# Altium project Luna v2.PrjPcb (part 4 of 7)

## Sheet 10 FLASH_BOOT.SchDoc: Luna v2
size A2; VersionControl_RevNumber: DNP; IsUserConfigurable: DNP; OrgAddr3: Sunrise FL 33323; OrgName: Pixels on Target; Page Create Date: March  8, 1995; Page Number: 5; Page Size: A2; Page Count: 14; OrgAddr2: Suite #104; RevCode: A; Doc: SCH30-00070-00; DsnPath: C:\Users\Carter Nichols\Documents\BitBucket boards (Cadence)\30-00070-00_Original\SCH30-00070-00.DSN; SchematicName: SC30-00070-00; PageName: 05-POWER IN; PageSize: A2; TopSchematic: True; Address4: United States
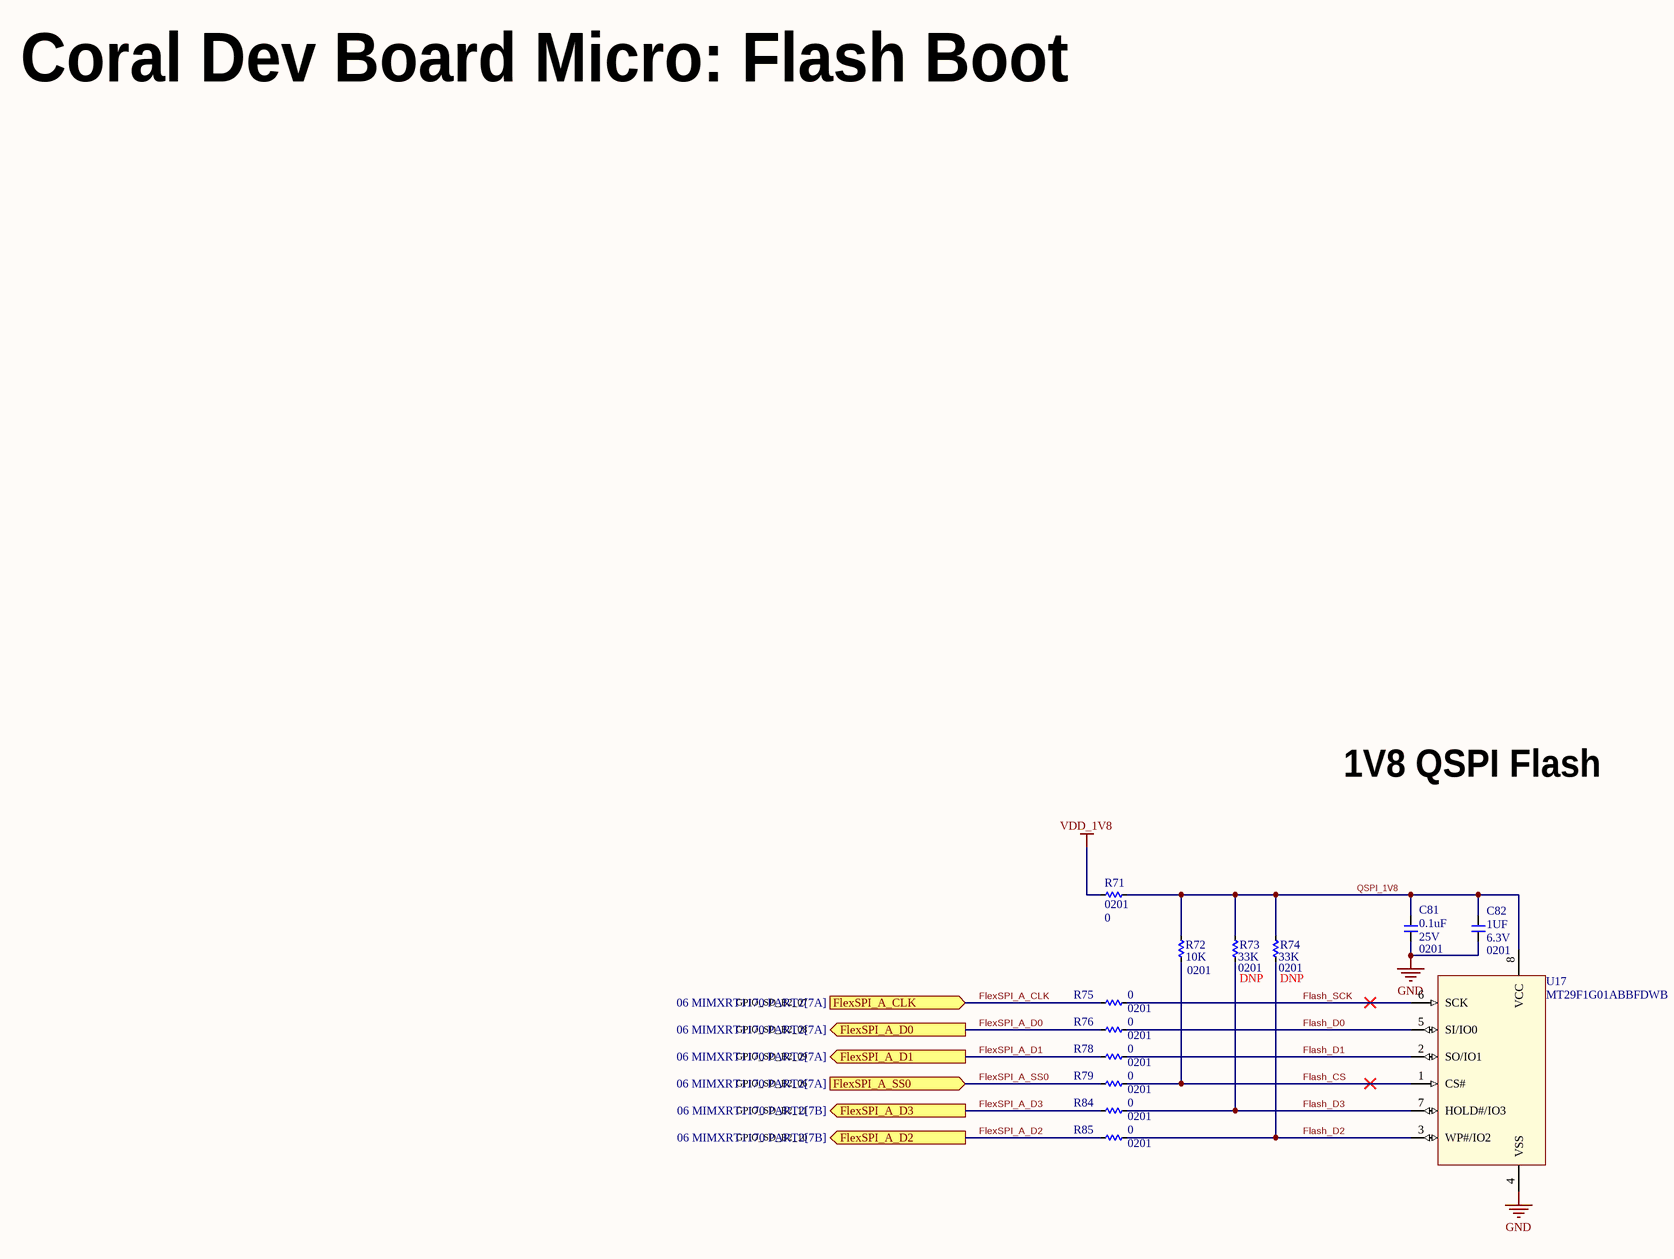
[diagram p15: 10 FLASH_BOOT.SchDoc]

### Parts
C81  value 0.1uF  Package: 0201  Voltage: 25V  [C0201Y]  (hidden comment: __Template_Cap)
C82  value 1UF  Package: 0201  Voltage: 6.3V  [C0201_H0.39MM]  (hidden comment: __Template_Cap)
R71  value 0  Package: 0201  [R0201]
R72  value 10K  Package: 0201  [R0201]
R73  value 33K  Package: 0201  [R0201]
R74  value 33K  Package: 0201  [R0201]
R75  value 0  Package: 0201  [R0201]
R76  value 0  Package: 0201  [R0201]
R78  value 0  Package: 0201  [R0201]
R79  value 0  Package: 0201  [R0201]
R84  value 0  Package: 0201  [R0201]
R85  value 0  Package: 0201  [R0201]
U17  MFG P/N: MT29F1G01ABBFDWB  [UDFN800X600X65-8]  (hidden comment: FLASH_MT29F1G01ABBFDWB)

### Ports
FlexSPI_A_CLK (in, see 06 MIMXRT1170 PART2[7A]), FlexSPI_A_D0 (out, see 06 MIMXRT1170 PART2[7A]), FlexSPI_A_D1 (out, see 06 MIMXRT1170 PART2[7A]), FlexSPI_A_D2 (out, see 06 MIMXRT1170 PART2[7B]), FlexSPI_A_D3 (out, see 06 MIMXRT1170 PART2[7B]), FlexSPI_A_SS0 (in, see 06 MIMXRT1170 PART2[7A])

### Nets
GND: C81.2 C82.2 U17.4(VSS)
VDD_1V8: R71.2
Flash_CS: R72.1 R79.2 U17.1(CS#)
Flash_D0: R76.2 U17.5(SI/IO0)
Flash_D1: R78.2 U17.2(SO/IO1)
Flash_D2: R74.1 R85.2 U17.3(WP#/IO2)
Flash_D3: R73.1 R84.2 U17.7(HOLD#/IO3)
Flash_SCK: R75.2 U17.6(SCK)
FlexSPI_A_CLK: R75.1 ; port FlexSPI_A_CLK
FlexSPI_A_D0: R76.1 ; port FlexSPI_A_D0
FlexSPI_A_D1: R78.1 ; port FlexSPI_A_D1
FlexSPI_A_D2: R85.1 ; port FlexSPI_A_D2
FlexSPI_A_D3: R84.1 ; port FlexSPI_A_D3
FlexSPI_A_SS0: R79.1 ; port FlexSPI_A_SS0
QSPI_1V8: C81.1 C82.1 R71.1 R72.2 R73.2 R74.2 U17.8(VCC)

### Notes on the sheet
- Coral Dev Board Micro: Flash Boot
- 1V8 QSPI Flash
- GPIO_SD_B2_07
- GPIO_SD_B2_08
- GPIO_SD_B2_06
- GPIO_SD_B2_09
- GPIO_SD_B2_11
- GPIO_SD_B2_10
- Title
- Size:
- Date:
- File:
- A2
- Number:
- Time:
- Revision:
- Sheet
- of

### Library data of the parts
C81 = 386: as C19 on sheet 08 B2B; Status: Released; Dielectric: X5R; Tolerance: 20%; Height: 0.33mm T; ComponentLink1Description: Datasheet; COMMON: 150-01204-00; LOON: 150-01204-00; Gecko: 150-01204-00
C82 = 1771: as C119 on sheet 07 MIMXRT1170 PART3; Status: In Development; Dielectric: X6S; Tolerance: 20%; Height: 0.39mm; Supplier 1: Digi-Key; HelpURL: https://www.digikey.com/product-detail/en/murata-electronics-north-america/GRM033C80J105ME05D/490-13218-1-ND/5877426; ComponentLink1Description: Datasheet; ComponentLink1URL: https://psearch.en.murata.com/capacitor/product/GRM033C80J105ME05%23.pdf; Supplier Part Number 1: 490-13218-1-ND
R71 R75 R76 R78 R79 R84 R85 = 8315: as R10 on sheet 06 MIMXRT1170 PART2; Status: Released; Power: 1/20W; LOON: 470-00013-00; Gecko: 470-00013-00; XPN: 470-00013-00
R72 = 4151: as R23 on sheet 06 MIMXRT1170 PART2; Status: Released; Power: 1/20W; Tolerance: 1%; Height: 0.26mm; Supplier 1: Digi-Key; LOON: 470-00033-00; Gecko: 470-00033-00; XPN: 470-00033-00; Supplier Part Number 1: 311-10.0KMCT-ND
R73 R74 = 8374: RES, 33K, 1%, 1/20W, 0201; ID: 8374; MFG: YAGEO; MFG P/N: RC0201FR-0733KL; COMMON: 470-00060-00; Status: Released; Power: 1/20W; Tolerance: 1%; LOON: 470-00060-00; Gecko: 470-00060-00; XPN: 470-00060-00; DNP: DNP
U17 = 428: IC, MEMORY, MT29F1G01ABB, NON-VOLATILE, FLASH, 1Gb(1G x 1), SPI, 1.7 TO 1.95V VIN, UDFN-8; ID: 428; MFG: Micron Technology Inc.; Status: Released; Package: 8-U-PDFN (8x6); Category: Integrated Circuits (ICs); RoHS Compliant: Yes; Supplier 1: Digi-Key; ComponentLink1Description: Datasheet; ComponentLink1URL: https://drive.google.com/file/d/1C-NTATQpKfaFS0xUlD5OwC7TQ7HH5Sp1/view; Mounting Type: SMD; Height: 0.65mm; Supplier Part Number 1: MT29F1G01ABBFDWB-IT:F-ND; HelpURL: https://www.digikey.com/en/products/detail/micron-technology-inc/mt29f1g01abbfdwb-it-f/7707445

## Sheet 11 SDRAM.SchDoc: Luna v2
size A2; VersionControl_RevNumber: DNP; IsUserConfigurable: DNP; OrgAddr3: Sunrise FL 33323; OrgName: Pixels on Target; Page Create Date: March  8, 1995; Page Number: 5; Page Size: A2; Page Count: 14; OrgAddr2: Suite #104; RevCode: A; Doc: SCH30-00070-00; DsnPath: C:\Users\Carter Nichols\Documents\BitBucket boards (Cadence)\30-00070-00_Original\SCH30-00070-00.DSN; SchematicName: SC30-00070-00; PageName: 05-POWER IN; PageSize: A2; TopSchematic: True; Address4: United States
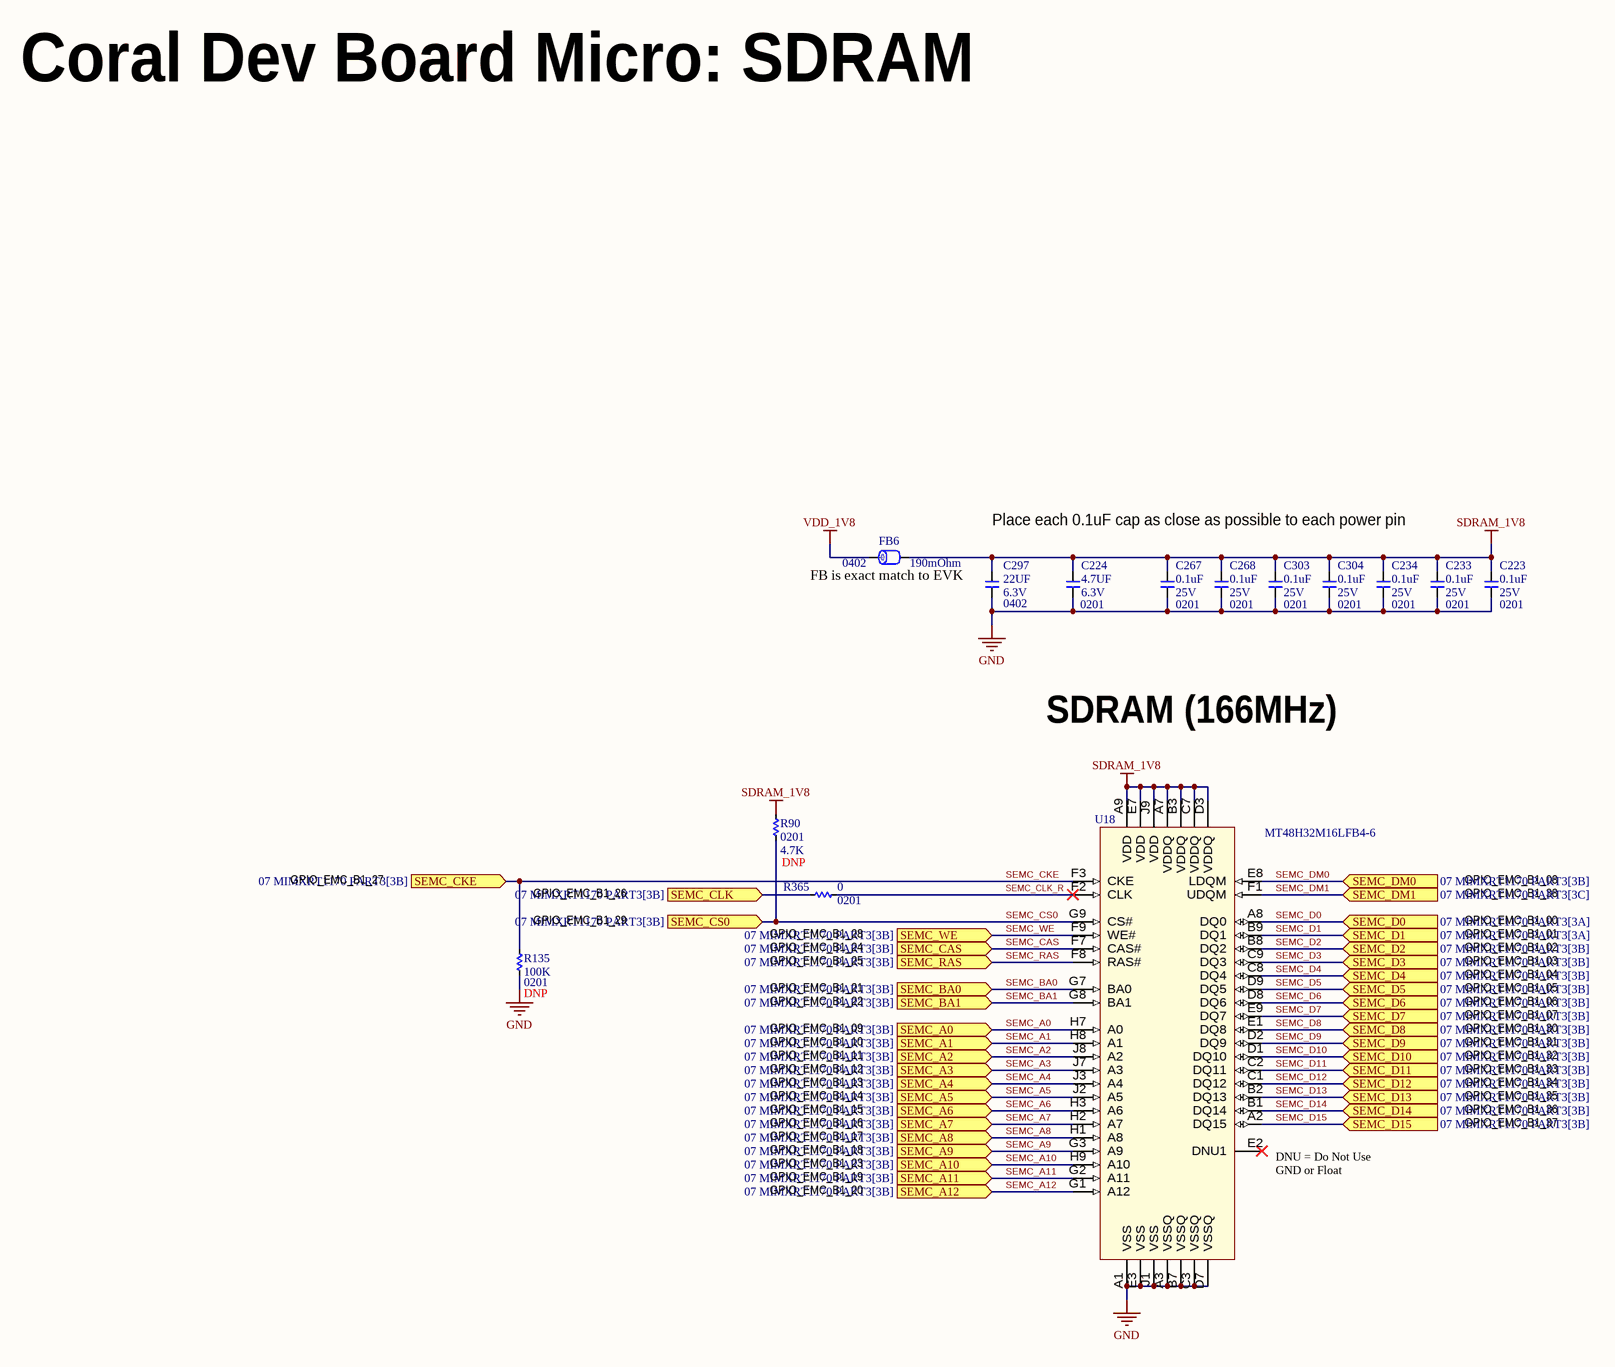
[diagram p16: 11 SDRAM.SchDoc]

### Parts
C223  value 0.1uF  Package: 0201  Voltage: 25V  [C0201Y]  (hidden comment: __Template_Cap)
C224  value 4.7UF  Package: 0201  Voltage: 6.3V  [C0201Y]  (hidden comment: __Template_Cap)
C233  value 0.1uF  Package: 0201  Voltage: 25V  [C0201Y]  (hidden comment: __Template_Cap)
C234  value 0.1uF  Package: 0201  Voltage: 25V  [C0201Y]  (hidden comment: __Template_Cap)
C267  value 0.1uF  Package: 0201  Voltage: 25V  [C0201Y]  (hidden comment: __Template_Cap)
C268  value 0.1uF  Package: 0201  Voltage: 25V  [C0201Y]  (hidden comment: __Template_Cap)
C297  value 22UF  Package: 0402  Voltage: 6.3V  [C0402]  (hidden comment: __Template_Cap)
C303  value 0.1uF  Package: 0201  Voltage: 25V  [C0201Y]  (hidden comment: __Template_Cap)
C304  value 0.1uF  Package: 0201  Voltage: 25V  [C0201Y]  (hidden comment: __Template_Cap)
FB6  Package: 0402  Rdc max: 190mOhm  [L0402_H0.55MM]  (hidden comment: __Template_Ferrite_Bead)
R90  value 4.7K  Package: 0201  [R0201]
R135  value 100K  Package: 0201  [R0201]
R365  value 0  Package: 0201  [R0201]
U18  MFG P/N: MT48H32M16LFB4-6  [BGA54C80P6X9_800X800X100]  (hidden comment: SDRAM_MT48H32M16LFB4-6)

### Ports
SEMC_A0 (in, see 07 MIMXRT1170 PART3[3B]), SEMC_A1 (in, see 07 MIMXRT1170 PART3[3B]), SEMC_A2 (in, see 07 MIMXRT1170 PART3[3B]), SEMC_A3 (in, see 07 MIMXRT1170 PART3[3B]), SEMC_A4 (in, see 07 MIMXRT1170 PART3[3B]), SEMC_A5 (in, see 07 MIMXRT1170 PART3[3B]), SEMC_A6 (in, see 07 MIMXRT1170 PART3[3B]), SEMC_A7 (in, see 07 MIMXRT1170 PART3[3B]), SEMC_A8 (in, see 07 MIMXRT1170 PART3[3B]), SEMC_A9 (in, see 07 MIMXRT1170 PART3[3B]), SEMC_A10 (in, see 07 MIMXRT1170 PART3[3B]), SEMC_A11 (in, see 07 MIMXRT1170 PART3[3B]), SEMC_A12 (in, see 07 MIMXRT1170 PART3[3B]), SEMC_BA0 (in, see 07 MIMXRT1170 PART3[3B]), SEMC_BA1 (in, see 07 MIMXRT1170 PART3[3B]), SEMC_CAS (in, see 07 MIMXRT1170 PART3[3B]), SEMC_CKE (in, see 07 MIMXRT1170 PART3[3B]), SEMC_CLK (in, see 07 MIMXRT1170 PART3[3B]), SEMC_CS0 (in, see 07 MIMXRT1170 PART3[3B]), SEMC_D0 (in, see 07 MIMXRT1170 PART3[3A]), SEMC_D1 (in, see 07 MIMXRT1170 PART3[3A]), SEMC_D2 (in, see 07 MIMXRT1170 PART3[3B]), SEMC_D3 (in, see 07 MIMXRT1170 PART3[3B]), SEMC_D4 (in, see 07 MIMXRT1170 PART3[3B]), SEMC_D5 (in, see 07 MIMXRT1170 PART3[3B]), SEMC_D6 (in, see 07 MIMXRT1170 PART3[3B]), SEMC_D7 (in, see 07 MIMXRT1170 PART3[3B]), SEMC_D8 (in, see 07 MIMXRT1170 PART3[3B]), SEMC_D9 (in, see 07 MIMXRT1170 PART3[3B]), SEMC_D10 (in, see 07 MIMXRT1170 PART3[3B]), SEMC_D11 (in, see 07 MIMXRT1170 PART3[3B]), SEMC_D12 (in, see 07 MIMXRT1170 PART3[3B]), SEMC_D13 (in, see 07 MIMXRT1170 PART3[3B]), SEMC_D14 (in, see 07 MIMXRT1170 PART3[3B]), SEMC_D15 (in, see 07 MIMXRT1170 PART3[3B]), SEMC_DM0 (in, see 07 MIMXRT1170 PART3[3B]), SEMC_DM1 (in, see 07 MIMXRT1170 PART3[3C]), SEMC_RAS (in, see 07 MIMXRT1170 PART3[3B]), SEMC_WE (in, see 07 MIMXRT1170 PART3[3B])

### Nets
GND: C223.2 C224.2 C233.2 C234.2 C267.2 C268.2 C297.2 C303.2 C304.2 R135.1 U18.A1(VSS) U18.A3(VSSQ) U18.B7(VSSQ) U18.C3(VSSQ) U18.D7(VSSQ) U18.E3(VSS) U18.J1(VSS)
SDRAM_1V8: C223.1 C224.1 C233.1 C234.1 C267.1 C268.1 C297.1 C303.1 C304.1 FB6.2 R90.2 U18.A7(VDDQ) U18.A9(VDD) U18.B3(VDDQ) U18.C7(VDDQ) U18.D3(VDDQ) U18.E7(VDD) U18.J9(VDD)
VDD_1V8: FB6.1
SEMC_A0: U18.H7(A0) ; port SEMC_A0
SEMC_A1: U18.H8(A1) ; port SEMC_A1
SEMC_A2: U18.J8(A2) ; port SEMC_A2
SEMC_A3: U18.J7(A3) ; port SEMC_A3
SEMC_A4: U18.J3(A4) ; port SEMC_A4
SEMC_A5: U18.J2(A5) ; port SEMC_A5
SEMC_A6: U18.H3(A6) ; port SEMC_A6
SEMC_A7: U18.H2(A7) ; port SEMC_A7
SEMC_A8: U18.H1(A8) ; port SEMC_A8
SEMC_A9: U18.G3(A9) ; port SEMC_A9
SEMC_A10: U18.H9(A10) ; port SEMC_A10
SEMC_A11: U18.G2(A11) ; port SEMC_A11
SEMC_A12: U18.G1(A12) ; port SEMC_A12
SEMC_BA0: U18.G7(BA0) ; port SEMC_BA0
SEMC_BA1: U18.G8(BA1) ; port SEMC_BA1
SEMC_CAS: U18.F7(CAS#) ; port SEMC_CAS
SEMC_CKE: R135.2 U18.F3(CKE) ; port SEMC_CKE
SEMC_CLK: R365.1 ; port SEMC_CLK
SEMC_CLK_R: R365.2 U18.F2(CLK)
SEMC_CS0: R90.1 U18.G9(CS#) ; port SEMC_CS0
SEMC_D0: U18.A8(DQ0) ; port SEMC_D0
SEMC_D1: U18.B9(DQ1) ; port SEMC_D1
SEMC_D2: U18.B8(DQ2) ; port SEMC_D2
SEMC_D3: U18.C9(DQ3) ; port SEMC_D3
SEMC_D4: U18.C8(DQ4) ; port SEMC_D4
SEMC_D5: U18.D9(DQ5) ; port SEMC_D5
SEMC_D6: U18.D8(DQ6) ; port SEMC_D6
SEMC_D7: U18.E9(DQ7) ; port SEMC_D7
SEMC_D8: U18.E1(DQ8) ; port SEMC_D8
SEMC_D9: U18.D2(DQ9) ; port SEMC_D9
SEMC_D10: U18.D1(DQ10) ; port SEMC_D10
SEMC_D11: U18.C2(DQ11) ; port SEMC_D11
SEMC_D12: U18.C1(DQ12) ; port SEMC_D12
SEMC_D13: U18.B2(DQ13) ; port SEMC_D13
SEMC_D14: U18.B1(DQ14) ; port SEMC_D14
SEMC_D15: U18.A2(DQ15) ; port SEMC_D15
SEMC_DM0: U18.E8(LDQM) ; port SEMC_DM0
SEMC_DM1: U18.F1(UDQM) ; port SEMC_DM1
SEMC_RAS: U18.F8(RAS#) ; port SEMC_RAS
SEMC_WE: U18.F9(WE#) ; port SEMC_WE

Not connected (* = marked no-connect by the designer): U18 E2(DNU1)*

### Notes on the sheet
- Coral Dev Board Micro: SDRAM
- FB is exact match to EVK
- Place each 0.1uF cap as close as possible to each power pin
- SDRAM (166MHz)
- GPIO_EMC_B1_27
- GPIO_EMC_B1_26
- GPIO_EMC_B1_38
- GPIO_EMC_B1_08
- (near R135) GPIO_EMC_B1_29
- GPIO_EMC_B1_21
- GPIO_EMC_B1_25
- (near R365) GPIO_EMC_B1_24
- (near R365) GPIO_EMC_B1_28
- GPIO_EMC_B1_00
- GPIO_EMC_B1_01
- GPIO_EMC_B1_02
- GPIO_EMC_B1_03
- GPIO_EMC_B1_04
- GPIO_EMC_B1_05
- GPIO_EMC_B1_10
- GPIO_EMC_B1_09
- GPIO_EMC_B1_22
- GPIO_EMC_B1_06
- GPIO_EMC_B1_07
- GPIO_EMC_B1_30
- GPIO_EMC_B1_31
- GPIO_EMC_B1_11
- GPIO_EMC_B1_12
- GPIO_EMC_B1_13
- GPIO_EMC_B1_14
- GPIO_EMC_B1_15
- GPIO_EMC_B1_16
- GPIO_EMC_B1_32
- GPIO_EMC_B1_33
- GPIO_EMC_B1_34
- GPIO_EMC_B1_35
- GPIO_EMC_B1_36
- GPIO_EMC_B1_37
- GPIO_EMC_B1_17
- GPIO_EMC_B1_18
- GPIO_EMC_B1_19
- GPIO_EMC_B1_23
- (near U18) DNU = Do Not Use
- (near U18) GND or Float
- GPIO_EMC_B1_20
- Title
- Size:
- Date:
- File:
- A2
- Number:
- Time:
- Revision:
- Sheet
- of

### Library data of the parts
C223 C233 C234 C267 C268 C303 C304 = 386: as C19 on sheet 08 B2B; Status: Released; Dielectric: X5R; Tolerance: 20%; Height: 0.33mm T; ComponentLink1Description: Datasheet; COMMON: 150-01204-00; LOON: 150-01204-00; Gecko: 150-01204-00
C224 = 1199: as C33 on sheet 06 MIMXRT1170 PART2; Status: Released; Dielectric: X5R; Tolerance: 20%; Height: 0.33mm T; ComponentLink1Description: Datasheet; COMMON: 150-01224-00; LOON: 150-01224-00; Gecko: 150-01224-00
C297 = 1719: CAP, CER, X5R, 22uF, 20%, 6.3V, 0402; ID: 1719; MFG: AVX; MFG P/N: 04026D226MAT2A; XPN: 150-00420-00; PROXY: 150-03491-00; Status: Released; Dielectric: X5R; Tolerance: 20%; Height: 0.70mm; Supplier 1: Digi-Key; HelpURL: https://www.digikey.in/product-detail/en/avx-corporation/04026D226MAT2A/478-9839-1-ND/5964924; ComponentLink1Description: Datasheet; ComponentLink1URL: http://datasheets.avx.com/cx5r.pdf; COMMON: 150-00420-00; LOON: 150-00420-00; Gecko: 150-00420-00; Supplier Part Number 1: 478-9839-1-ND
FB6 = 913: as FB3-FB5 on sheet 07 MIMXRT1170 PART3; ComponentLink1Description: Datasheet; Status: Released; Idc max: 550mA; Supplier 1: Digi-Key; HelpURL: https://www.digikey.com/product-detail/en/murata-electronics/BLM15AG121SN1D/490-1005-1-ND/584453; ComponentLink1URL: https://www.murata.com/en-us/products/productdata/8796740059166/ENFA0018.pdf; Height: 0.55mm; Supplier Part Number 1: 490-1005-1-ND
R90 = 6602: as R37 on sheet 06 MIMXRT1170 PART2; Status: Released; Power: 1/20W; Tolerance: 5%; LOON: 470-00012-00; Gecko: 470-00012-00; XPN: 470-00012-00; DNP: DNP
R135 = 6760: as R21 on sheet 06 MIMXRT1170 PART2; Status: Released; Power: 1/20W; Tolerance: 1%; LOON: 470-00506-00; Gecko: 470-00506-00; XPN: 470-00506-00; DNP: DNP
R365 = 8315: as R10 on sheet 06 MIMXRT1170 PART2; Status: Released; Power: 1/20W; LOON: 470-00013-00; Gecko: 470-00013-00; XPN: 470-00013-00
U18 = 427: IC, MEMORY, MT48H32M16, VOLATILE, DRAM, 512Mb(32M x 16), 1.7 TO 1.95V VIN, VFBGA-54; ID: 427; MFG: Micron Technology Inc.; Status: Released; Package: 54-VFBGA (8x8); Category: Integrated Circuits (ICs); RoHS Compliant: Yes; Supplier 1: Digi-Key; ComponentLink1Description: Datasheet; ComponentLink1URL: https://drive.google.com/file/d/1ZqN_IvmDCh6UxoJlg56_oHNDqlNjxBG5/view; Mounting Type: SMD; Height: 1mm; Supplier Part Number 1: MT48H32M16LFB4-6IT:C-ND; HelpURL: https://www.digikey.com/en/products/detail/micron-technology-inc/mt48h32m16lfb4-6-it-c/4315912